# Altium schematic sheet Major Buzz Kill.SchDoc (part 1 of 4)
size 342 x 203 mm
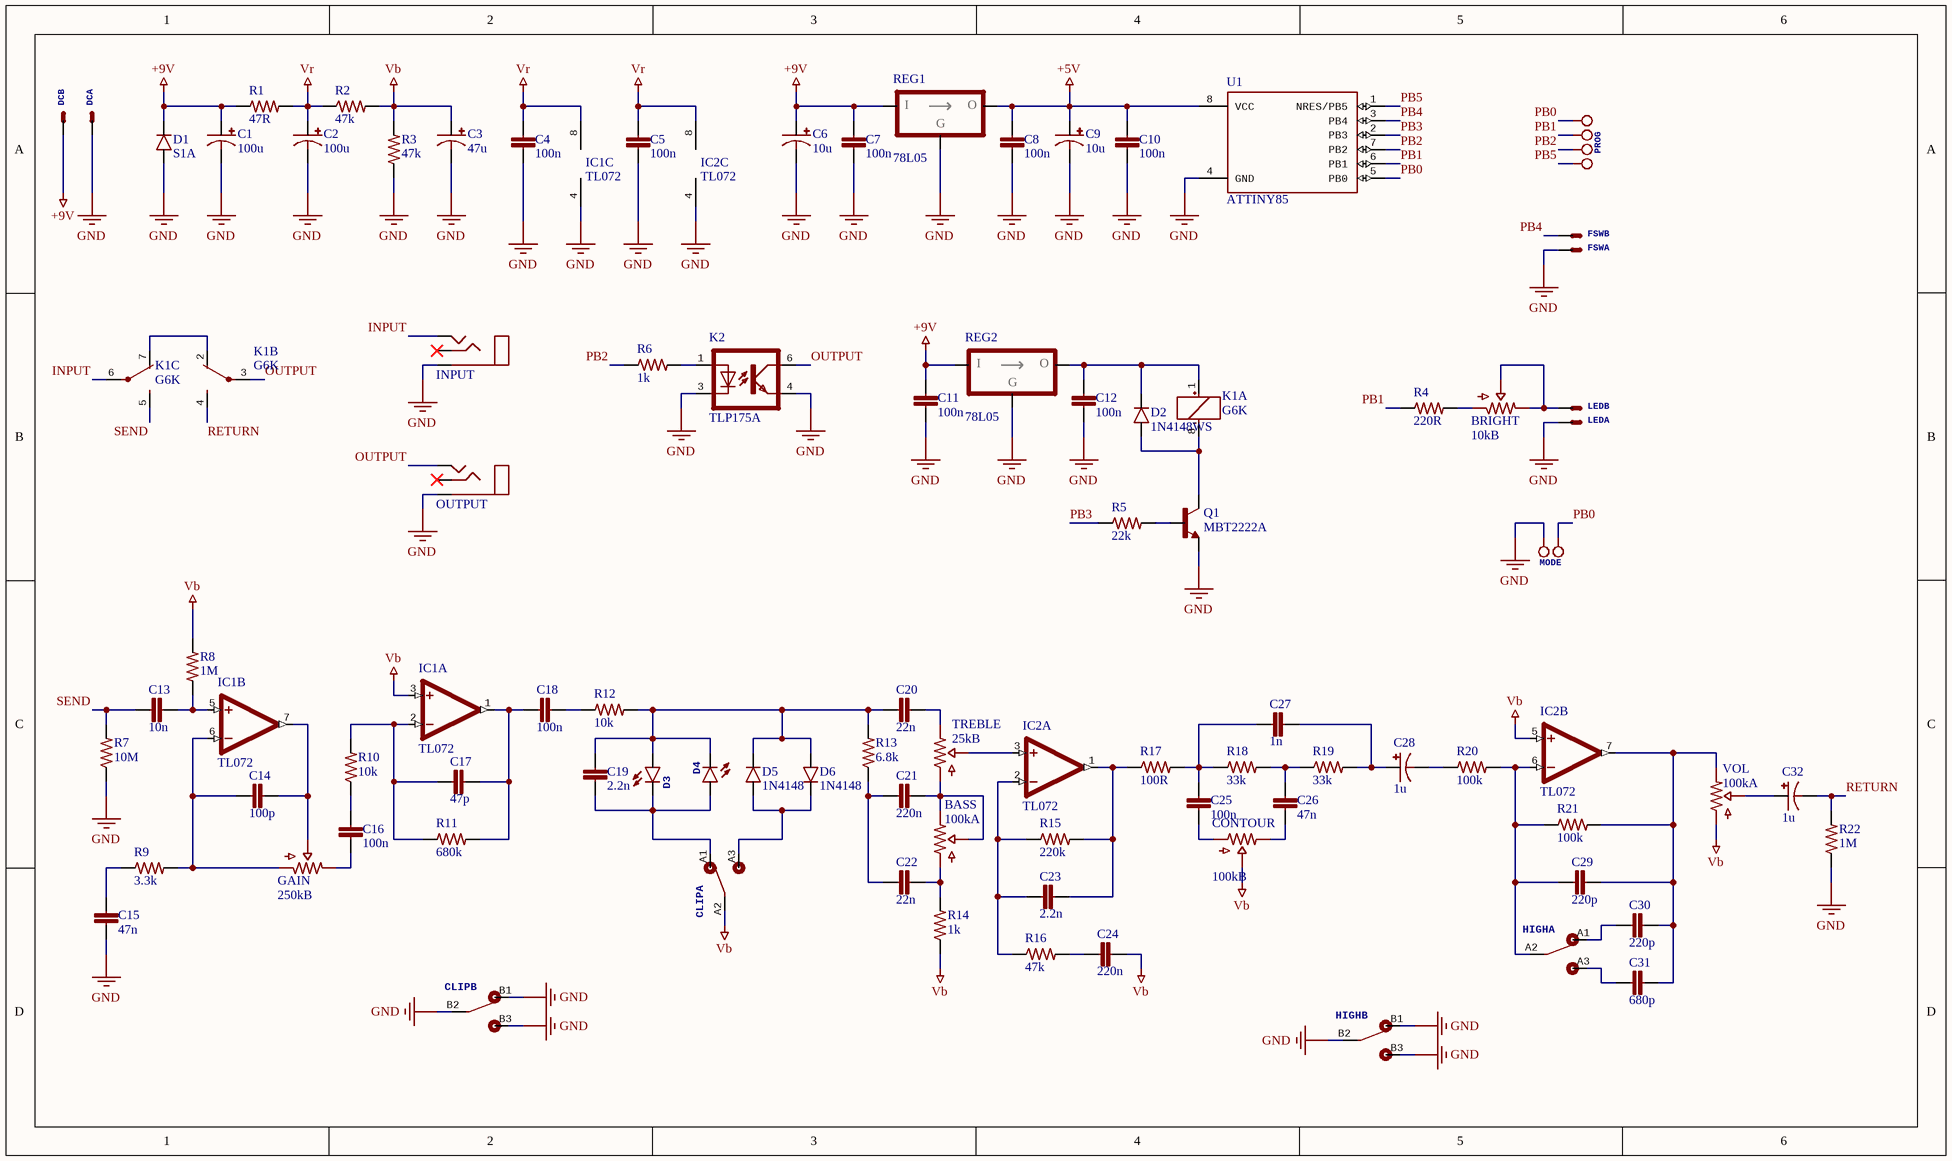
[diagram p0: Major Buzz Kill.SchDoc]

## Parts
BASS  100kA  [ALPHA_16mm_BOTTOM]
BRIGHT  10kB  [BOURNS_3362P]
C1  100u  [CAPAE_D]
C2  100u  [CAPAE_D]
C3  47u  [CAPAE_D]
C4  100n  [CHIP_0603]
C5  100n  [CHIP_0603]
C6  10u  [CAPAE_B]
C7  100n  [CHIP_0603]
C8  100n  [CHIP_0603]
C9  10u  [CAPAE_B]
C10  100n  [CHIP_0603]
C11  100n  [CHIP_0603]
C12  100n  [CHIP_0603]
C13  10n  [CHIP_0603]
C14  100p  [CHIP_0603]
C15  47n  [CHIP_0603]
C16  100n  [CHIP_1206]
C17  47p  [CHIP_0603]
C18  100n  [CHIP_1206]
C19  2.2n  [CHIP_0603]
C20  22n  [CHIP_0805]
C21  220n  [CHIP_0603]
C22  22n  [CHIP_0805]
C23  2.2n  [CHIP_0603]
C24  220n  [CHIP_0603]
C25  100n  [CHIP_1206]
C26  47n  [CHIP_1206]
C27  1n  [CHIP_0603]
C28  1u  [CAPAE_B]
C29  220p  [CHIP_0603]
C30  220p  [CHIP_0603]
C31  680p  [CHIP_0603]
C32  1u  [CAPAE_B]
CLIP  DPDT  [DPDT_SLIDE]  (value not drawn)  (parts A,B of 2)
CONTOUR  100kB  [ALPHA_16mm_BOTTOM]
D1  S1A  [DO214]
D2  1N4148WS  [SOD323]
D3  D_LED  [LED_3MM]  (value not drawn)
D4  D_LED  [LED_3MM]  (value not drawn)
D5  1N4148  [DO35_2]
D6  1N4148  [DO35_2]
DC  J_JST-XH-02  [JST-XH-02]  (value not drawn)  (parts A,B of 2)
FSW  J_JST-XH-02  [JST-XH-02]  (value not drawn)  (parts A,B of 2)
GAIN  250kB  [ALPHA_16mm_BOTTOM]
HIGH  DPDT  [DPDT_SLIDE]  (value not drawn)  (parts A,B of 2)
IC1  TL072  [SO-8]  (parts A,B,C of 3)
IC2  TL072  [SO-8]  (parts A,B,C of 3)
INPUT  J_STEREO  [STEREO]  (value not drawn)
K1  G6K  [G6K]  (parts A,B,C of 3)
K2  TLP175A  [TLP175A]
LED  J_JST-XH-02  [JST-XH-02]  (value not drawn)  (parts A,B of 2)
MODE  J_HEADER_2PINS  [HEADER_2PINS]  (value not drawn)
OUTPUT  J_STEREO  [STEREO]  (value not drawn)
PROG  J_HEADER_4PINS_FEM  [HEADER_4Pins_FEM]  (value not drawn)
Q1  MBT2222A  [SOT323]
R1  47R  [CHIP_R_1206]
R2  47k  [CHIP_R_1206]
R3  47k  [CHIP_R_1206]
R4  220R  [CHIP_R_1206]
R5  22k  [CHIP_R_0603]
R6  1k  [CHIP_R_0603]
R7  10M  [CHIP_R_0603]
R8  1M  [CHIP_R_0603]
R9  3.3k  [CHIP_R_0603]
R10  10k  [CHIP_R_0603]
R11  680k  [CHIP_R_0603]
R12  10k  [CHIP_R_0603]
R13  6.8k  [CHIP_R_0603]
R14  1k  [CHIP_R_0603]
R15  220k  [CHIP_R_0603]
R16  47k  [CHIP_R_0603]
R17  100R  [CHIP_R_0603]
R18  33k  [CHIP_R_0603]
R19  33k  [CHIP_R_0603]
R20  100k  [CHIP_R_0603]
R21  100k  [CHIP_R_0603]
R22  1M  [CHIP_R_0603]
REG1  78L05  [SOT23-3]
REG2  78L05  [SOT23-3]
TREBLE  25kB  [ALPHA_16mm_BOTTOM]
U1  ATTINY85  [SOP8]
VOL  100kA  [ALPHA_16mm_BOTTOM]

## Nets
+5V: C8.1 C9.+ C10.1 REG1.1(OUTPUT) U1.8(VCC)
+9V: C1.+ C6.+ C7.1 C11.1 D1.1 DC.1(S) R1.1 REG1.2(INPUT) REG2.2(INPUT)
GND: C1.- C2.- C3.- C4.2 C5.2 C6.- C7.2 C8.2 C9.- C10.2 C11.2 C12.2 C15.2 CLIP.B1 CLIP.B2 CLIP.B3 D1.2 DC.2(S) FSW.2(S) HIGH.B1 HIGH.B2 HIGH.B3 IC1.4(V-) IC2.4(V-) INPUT.S K2.3(C) K2.4(EMIT) LED.2(S) MODE.1 OUTPUT.S Q1.2(E) R3.1 R7.1 R22.1 REG1.3(COMMON) REG2.3(COMMON) U1.4(GND)
Vb: C3.+ C24.1 CLIP.A2 CONTOUR.2 IC1.3(+IN) IC2.5(+IN) R2.2 R3.2 R8.2 R14.1 VOL.1
Vr: C2.+ C4.1 C5.1 IC1.8(V+) IC2.8(V+) R1.2 R2.1
INPUT: INPUT.T K1.6(P)
OUTPUT: K1.3(P) K2.6(COL) OUTPUT.T
PB0: MODE.2 PROG.4 U1.5(PB0)
PB1: PROG.3 R4.1 U1.6(PB1)
PB2: PROG.2 R6.1 U1.7(PB2)
PB3: R5.1 U1.2(PB3)
PB4: FSW.1(S) U1.3(PB4)
PB5: PROG.1 U1.1(NRES/PB5)
RETURN: C32.- K1.4(S) R22.2
SEND: C13.2 K1.5(S) R7.2
NetBASS_1: BASS.1 C22.1 R14.2
NetBASS_2: BASS.2 BASS.3 C21.1 TREBLE.1
NetBRIGHT_1: BRIGHT.1 R4.2
NetBRIGHT_2: BRIGHT.2 BRIGHT.3 LED.1(S)
NetC12_1: C12.1 D2.1 K1.1(+) REG2.1(OUTPUT)
NetC13_1: C13.1 IC1.5(+IN) R8.1
NetC14_1: C14.1 GAIN.2 IC1.7(OUT)
NetC14_2: C14.2 GAIN.1 IC1.6(-IN) R9.2
NetC15_1: C15.1 R9.1
NetC16_1: C16.1 R10.1
NetC16_2: C16.2 GAIN.3
NetC17_1: C17.1 C18.2 IC1.1(OUT) R11.2
NetC17_2: C17.2 IC1.2(-IN) R10.2 R11.1
NetC18_1: C18.1 R12.1
NetC19_1: C19.1 C20.2 D3.ANODE(A) D4.P$1(C) D5.C D6.A R12.2 R13.2
NetC19_2: C19.2 CLIP.A1 D3.P$1(C) D4.ANODE(A)
NetC20_1: C20.1 TREBLE.3
NetC21_2: C21.2 C22.2 R13.1
NetC23_1: C23.1 IC2.1(OUT) R15.2 R17.1
NetC23_2: C23.2 IC2.2(-IN) R15.1 R16.1
NetC24_2: C24.2 R16.2
NetC25_1: C25.1 C27.2 R17.2 R18.1
NetC25_2: C25.2 CONTOUR.1
NetC26_1: C26.1 R18.2 R19.1
NetC26_2: C26.2 CONTOUR.3
NetC27_1: C27.1 C28.+ R19.2
NetC28_-: C28.- R20.1
NetC29_1: C29.1 C30.1 C31.1 IC2.7(OUT) R21.2 VOL.3
NetC29_2: C29.2 HIGH.A2 IC2.6(-IN) R20.2 R21.1
NetC30_2: C30.2 HIGH.A1
NetC31_2: C31.2 HIGH.A3
NetC32_+: C32.+ VOL.2
NetCLIP_A3: CLIP.A3 D5.A D6.C
NetD2_2: D2.2 K1.8(-) Q1.3(C)
NetIC2_3: IC2.3(+IN) TREBLE.2
NetK1_2: K1.2(O) K1.7(O)
NetK2_1: K2.1(A) R6.2
NetQ1_1: Q1.1(B) R5.2

Not connected (* = marked no-connect by the designer): INPUT R*; OUTPUT R*